# EAGLE design 1 (EAGLE 9.4.2)
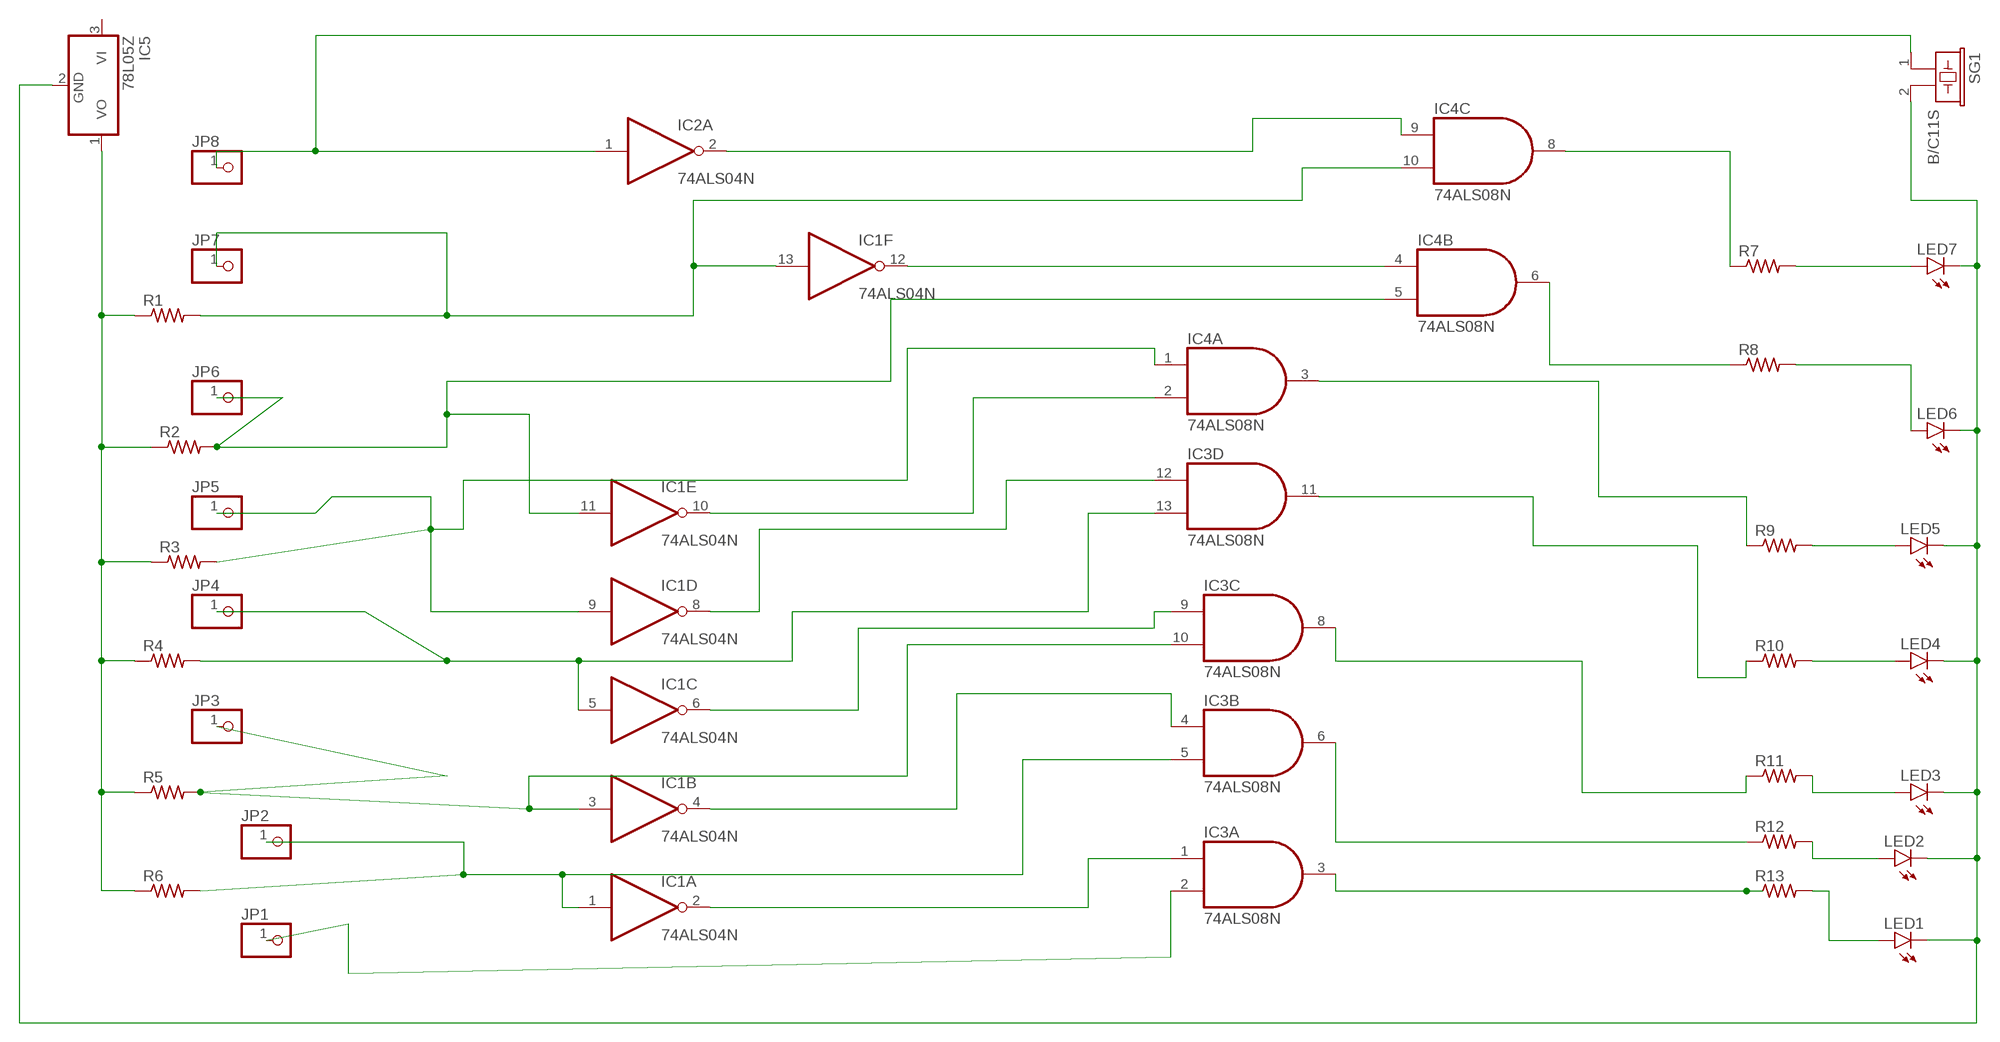
[diagram p0: schematic, sheet 1]

## Parts
IC1  74ALS04N  [DIL14]
IC2  74ALS04N  [DIL14]
IC3  74ALS08N  [DIL14]
IC4  74ALS08N  [DIL14]
IC5  78L05Z  [TO92]
JP1  PINHD-1X1  [1X01]
JP2  PINHD-1X1  [1X01]
JP3  PINHD-1X1  [1X01]
JP4  PINHD-1X1  [1X01]
JP5  PINHD-1X1  [1X01]
JP6  PINHD-1X1  [1X01]
JP7  PINHD-1X1  [1X01]
JP8  PINHD-1X1  [1X01]
LED1  LED10MM  [LED10MM]
LED2  LED10MM  [LED10MM]
LED3  LED10MM  [LED10MM]
LED4  LED10MM  [LED10MM]
LED5  LED10MM  [LED10MM]
LED6  LED10MM  [LED10MM]
LED7  LED10MM  [LED10MM]
R1  R-US_0204/5  [0204/5]
R2  R-US_0204/5  [0204/5]
R3  R-US_0204/5  [0204/5]
R4  R-US_0204/5  [0204/5]
R5  R-US_0204/5  [0204/5]
R6  R-US_0204/5  [0204/5]
R7  R-US_0204/5  [0204/5]
R8  R-US_0204/5  [0204/5]
R9  R-US_0204/5  [0204/5]
R10  R-US_0204/5  [0204/5]
R11  R-US_0204/5  [0204/5]
R12  R-US_0204/5  [0204/5]
R13  R-US_0204/5  [0204/5]
SG1  B/C11S  [B/C11S]

## Nets
N$1: IC1.1(A:I) IC3.5(B:I1) JP2.1 R6.2
N$2: IC1.3(B:I) IC3.10(C:I1) JP3.1 R5.2
N$3: IC1.5(C:I) IC3.13(D:I1) JP4.1 R4.2
N$4: IC1.9(D:I) IC4.1(A:I0) JP5.1 R3.2
N$5: IC1.11(E:I) IC4.5(B:I1) JP6.1 R2.2
N$6: IC1.13(F:I) IC4.10(C:I1) JP7.1 R1.2
N$7: IC1.2(A:O) IC3.1(A:I0)
N$8: IC1.4(B:O) IC3.4(B:I0)
N$9: IC1.6(C:O) IC3.9(C:I0)
N$10: IC1.8(D:O) IC3.12(D:I0)
N$11: IC1.10(E:O) IC4.2(A:I1)
N$12: IC1.12(F:O) IC4.4(B:I0)
N$13: IC3.2(A:I1) JP1.1
N$14: IC3.3(A:O) R13.1
N$15: IC4.8(C:O) R7.1
N$16: IC3.11(D:O) R10.1
N$17: IC4.3(A:O) R9.1
N$18: IC2.2(A:O) IC4.9(C:I0)
N$19: IC3.8(C:O) R11.1
N$20: IC3.6(B:O) R12.1
N$21: IC2.1(A:I) JP8.1 SG1.1
N$22: IC4.6(B:O) R8.1
N$23: LED1.A R13.2
N$24: LED2.A R12.2
N$25: LED3.A R11.2
N$26: LED4.A R10.2
N$27: LED5.A R9.2
N$28: LED6.A R8.2
N$29: LED7.A R7.2
N$30: IC5.1(VO) R1.1 R2.1 R3.1 R4.1 R5.1 R6.1
N$31: IC5.2(GND) LED1.K(C) LED2.K(C) LED3.K(C) LED4.K(C) LED5.K(C) LED6.K(C) LED7.K(C) SG1.2
Unconnected: IC2.3(B:I) IC2.4(B:O) IC2.5(C:I) IC2.6(C:O) IC2.8(D:O) IC2.9(D:I) IC2.10(E:O) IC2.11(E:I) IC2.12(F:O) IC2.13(F:I) IC4.11(D:O) IC4.12(D:I0) IC4.13(D:I1) IC5.3(VI)

## Power pins joined to a net without a drawn wire
GND: IC1.7(P:GND) IC2.7(P:GND) IC3.7(P:GND) IC4.7(P:GND)
VCC: IC1.14(P:VCC) IC2.14(P:VCC) IC3.14(P:VCC) IC4.14(P:VCC)

## Library data of the parts
IC1 IC2 = 74xx-us:74*04: Hex INVERTER
IC3 IC4 = 74xx-us:74*08: Quad 2-input AND gate
IC5 = linear:78*: Positive VOLTAGE REGULATOR Source: http://cache.national.com/ds/LM/LM78L05.pdf http://www.fairchildsemi.com/ds/LM/LM7805.pdf
JP1-JP8 = pinhead:PINHD-1X1: PIN HEADER
LED1-LED7 = led:LED: LED OSRAM: - CHIPLED LG R971, LG N971, LY N971, LG Q971, LY Q971, LO R971, LY R971 LH N974, LH R974 LS Q976, LO Q976, LY Q976 LO Q996 - Hyper CHIPLED LW Q18S LB Q993, LB Q99A, LB R99A - SideLED LS A670, LO A670, LY A670, LG A670, LP A670 LB A673, LV A673, LT A673, LW A673 LH A674 LY A675 LS A676, LA A676, LO A676, LY A676, LW A676 LS A679, LY A679, LG A679 - Hyper Micro SIDELED® LS Y876, LA Y876, LO Y876, LY Y876 LT Y87S - SmartLED LW L88C, LW L88S LB L89C, LB L89S, LG L890 LS L89K, LO L89K, LY L89K LS L896, LA L896, LO L896, LY L896 - TOPLED LS T670, LO T670, LY T670, LG T670, LP T670 LSG T670, LSP T670, LSY T670, LOP T670, LYG T670 LG T671, LOG T671, LSG T671 LB T673, LV T673, LT T673, LW T673 LH T674 LS T676, LA T676, LO T676, LY T676, LB T676, LH T676, LSB T676, LW T676 LB T67C, LV T67C, LT T67C, LS T67K, LO T67K, LY T67K, LW E67C LS E67B, LA E67B, LO E67B, LY E67B, LB E67C, LV E67C, LT E67C LW T67C LS T679, LY T679, LG T679 LS T770, LO T770, LY T770, LG T770, LP T770 LB T773, LV T773, LT T773, LW T773 LH T774 LS E675, LA E675, LY E675, LS T675 LS T776, LA T776, LO T776, LY T776, LB T776 LHGB T686 LT T68C, LB T68C - Hyper Mini TOPLED® LB M676 - Mini TOPLED Santana® LG M470 LS M47K, LO M47K, LY M47K Source: http://www.osram.convergy.de LUXEON: - LUMILED® LXK2-PW12-R00, LXK2-PW12-S00, LXK2-PW14-U00, LXK2-PW14-V00 LXK2-PM12-R00, LXK2-PM12-S00, LXK2-PM14-U00 LXK2-PE12-Q00, LXK2-PE12-R00, LXK2-PE12-S00, LXK2-PE14-T00, LXK2-PE14-U00 LXK2-PB12-K00, LXK2-PB12-L00, LXK2-PB12-M00, LXK2-PB14-N00, LXK2-PB14-P00, LXK2-PB14-Q00 LXK2-PR12-L00, LXK2-PR12-M00, LXK2-PR14-Q00, LXK2-PR14-R00 LXK2-PD12-Q00, LXK2-PD12-R00, LXK2-PD12-S00 LXK2-PH12-R00, LXK2-PH12-S00 LXK2-PL12-P00, LXK2-PL12-Q00, LXK2-PL12-R00 Source: www.luxeon.com KINGBRIGHT: KA-3528ASYC Source: www.kingbright.com
R1-R13 = rcl:R-US_: RESISTOR, American symbol; SPICEPREFIX: R
SG1 = buzzer:B/C11S: BUZZER Source: Buerklin; OC_FARNELL: unknown; OC_NEWARK: unknown

## Board
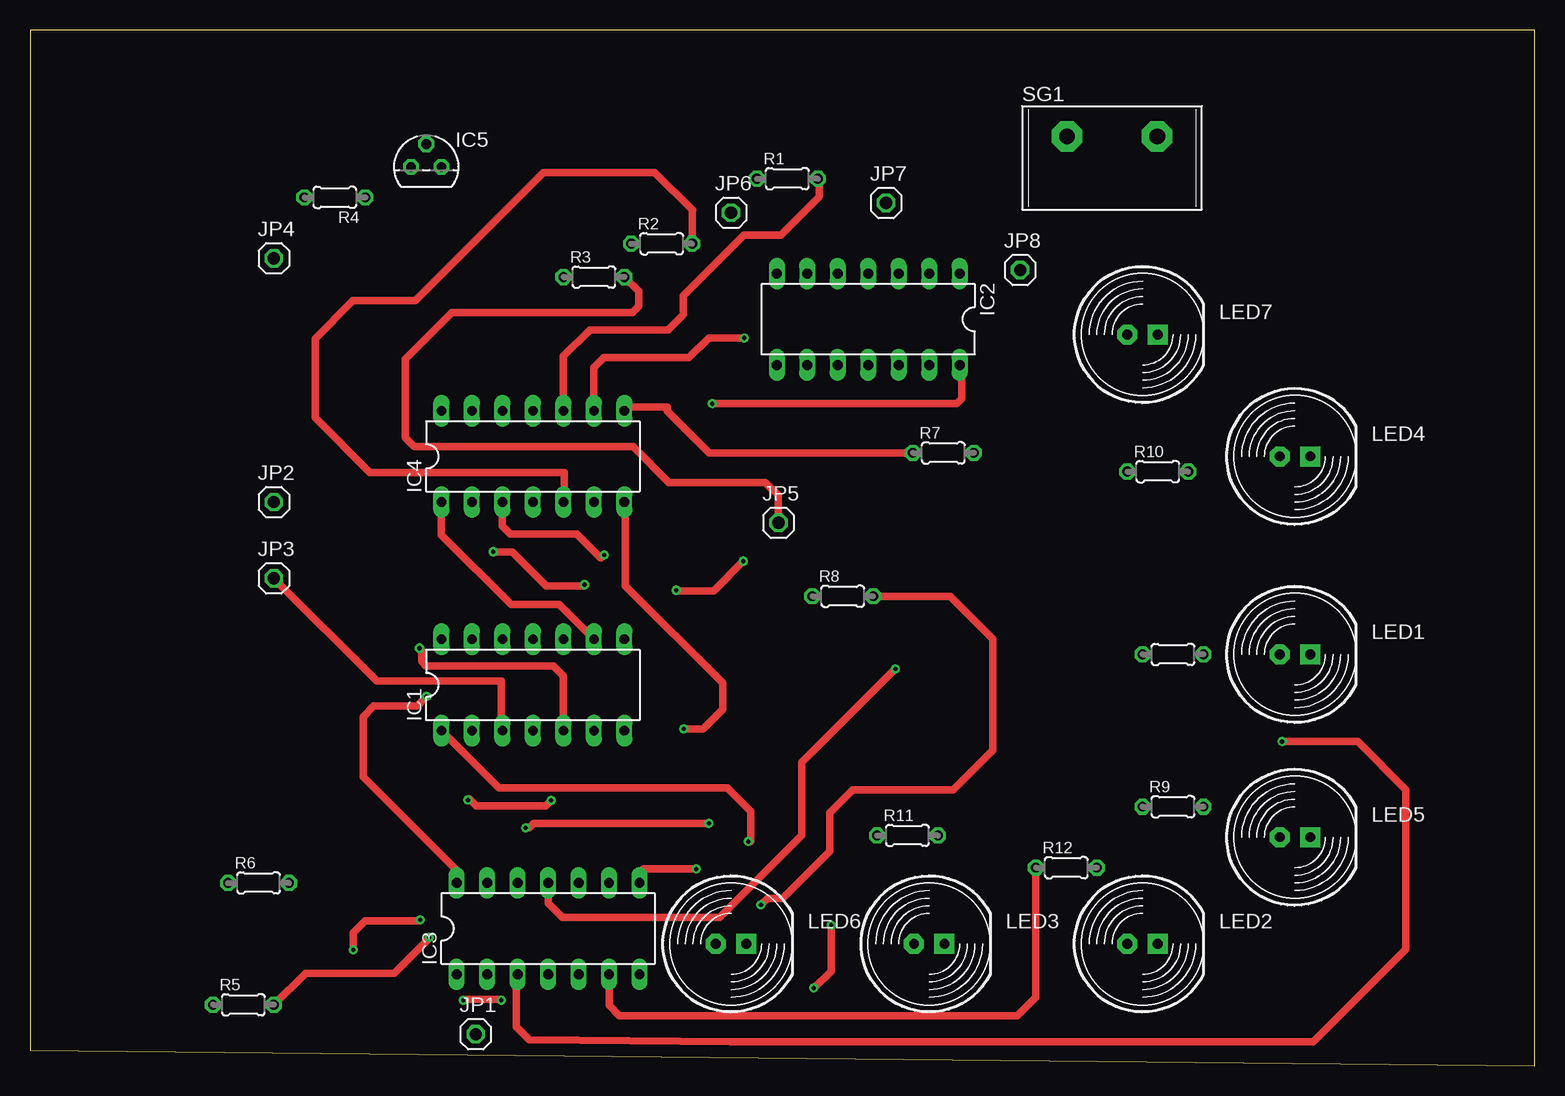
[diagram p1: board, top side]
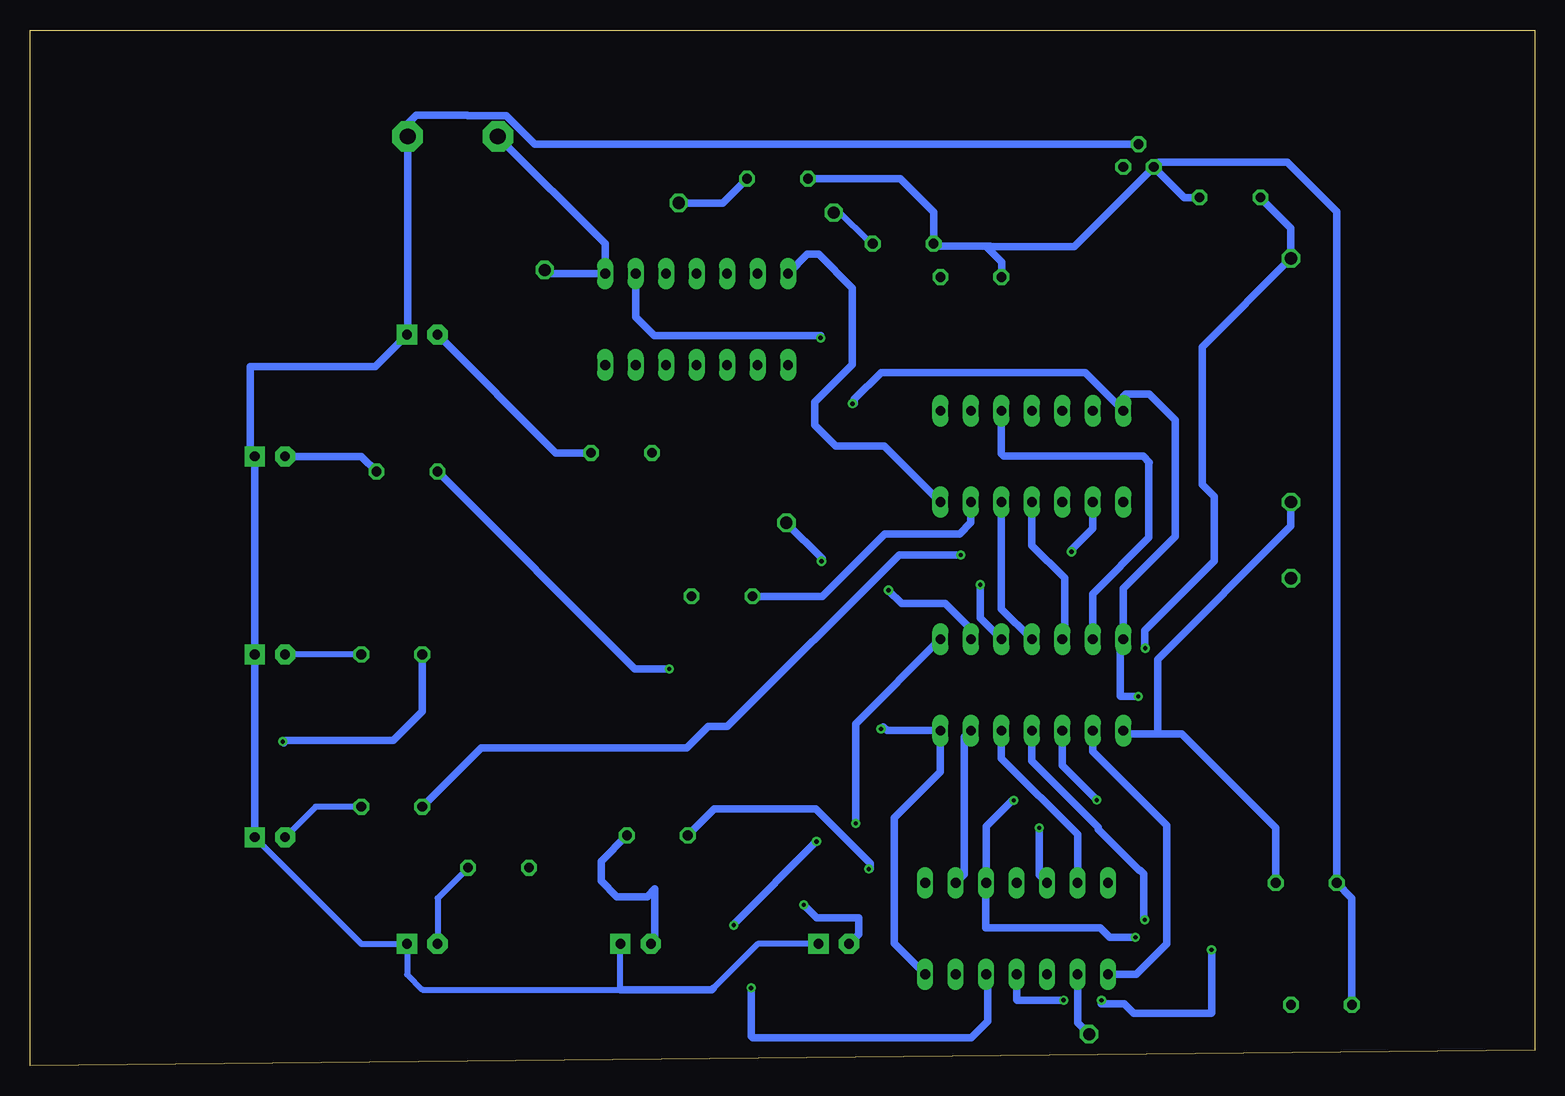
[diagram p2: board, bottom side, seen from below]

Size 125.4 x 86.35 mm. Coordinates in mm from the lower left corner, seen from the top.
Outline: 0,1.27 125.4,0 125.4,86.35 0,86.35 0,1.27
Copper layers (1*16): Top 0.035mm / dielectric 1.5mm / Bottom 0.035mm
Design rules "default": minimum track width 6mil, minimum drill 0.35mm, track to track 6mil, track to pad 6mil, pad to pad 6mil, via to via 6mil, smd to smd 6mil, copper to edge 40mil, drill to drill 6mil, minimum pad ring 10mil, minimum via ring 8mil, stop-mask expansion 4mil, vias tented up to drill 0mil, thermal gap 10mil

### Footprints (pad centres in the part's own frame; a part is rotated, then mirrored left to right if it is on the bottom)
DIL14 = drill 0.813 long: 1 -7.62,-3.81; 2 -5.08,-3.81; 3 -2.54,-3.81; 4 0,-3.81; 5 2.54,-3.81; 6 5.08,-3.81; 7 7.62,-3.81; 8 7.62,3.81; 9 5.08,3.81; 10 2.54,3.81; 11 0,3.81; 12 -2.54,3.81; 13 -5.08,3.81; 14 -7.62,3.81
TO92 = drill 0.813 octagon: 1 -1.27,0; 2 0,1.905; 3 1.27,0
1X01 = drill 1.016 octagon: 1 0,0
LED10MM = drill 0.813 pad 1.676 octagon: A -1.27,0 | drill 0.813 pad 1.676 square: K 1.27,0
0204/5 = drill 0.813 octagon: 1 -2.54,0; 2 2.54,0
B/C11S = drill 1.321 pad 2.54 octagon: 1 -3.759,0; 2 3.759,0

### Placement (x,y rotation side)
IC1  41.91,31.75 0 top
IC2  69.85,62.23 180 top
IC3  43.18,11.43 0 top
IC4  41.91,50.8 0 top
IC5  33.02,74.93 0 top
JP1  37.14,2.63 0 top
JP2  20.32,46.99 0 top
JP3  20.32,40.64 0 top
JP4  20.32,67.31 0 top
JP5  62.37,45.26 0 top
JP6  58.42,71.12 0 top
JP7  71.34,71.93 0 top
JP8  82.51,66.34 0 top
LED1  105.41,34.29 0 top
LED2  92.71,10.16 0 top
LED3  74.93,10.16 0 top
LED4  105.41,50.8 0 top
LED5  105.41,19.05 0 top
LED6  58.42,10.16 0 top
LED7  92.71,60.96 0 top
R1  63.11,73.95 0 top
R2  52.64,68.53 0 top
R3  46.99,65.75 0 top
R4  25.4,72.39 180 top
R5  17.78,5.08 0 top
R6  19.05,15.24 0 top
R7  76.11,51.09 0 top
R8  67.73,39.14 0 top
R9  95.25,21.59 0 top
R10  93.98,49.53 0 top
R11  73.12,19.2 0 top
R12  86.36,16.51 0 top
R13  95.25,34.29 0 top
SG1  90.17,77.47 0 top

### Tracks (layer width: path | path; a pad name or v marks a point on that pad's centre or on a via)
GND  (via drill 0.35)
  Top 0.61: v54.48,28.07 56.09,28.07 57.72,29.71 57.72,31.91 49.62,40.01 49.62,47.24 49.53,47.15 IC4.7
  Bottom 0.61: IC3.7 53.38,10.2 53.38,20.66 49.53,24.51 IC1.7 53.98,27.94 54.3,28.26 v54.48,28.07 | IC4.7 54.22,51.68 58.25,51.68 60,53.43 60,55.33 56.88,58.45 56.88,64.84 59.69,67.65 60.62,67.65 IC2.7
N$1  (via drill 0.35)
  Top 0.61: IC1.1 39.05,23.18 58.11,23.18 60.08,21.21 60.08,18.69 v59.86,18.69 | v66.76,11.72 66.76,7.89 65.33,6.46 v65.31,6.48
  Bottom 0.61: JP2.1 20.32,45 31.44,33.88 31.44,27.65 | 31.44,27.65 34,27.65 IC1.1 | R6.2 21.59,19.81 29.43,27.65 31.44,27.65 | v59.86,18.69 66.72,11.83 66.72,11.72 v66.76,11.72 | v65.31,6.48 65.31,2.47 65.16,2.32 46.97,2.32 45.6,3.69 45.6,7.5 IC3.5
N$2  (via drill 0.35)
  Top 0.61: JP3.1 28.88,32.08 39.25,32.08 39.25,28.06 IC1.3 | R5.2 22.96,7.72 30.34,7.72 33.3,10.68 v33.28,10.7 | v43.42,22.11 42.96,21.65 37.18,21.65 36.59,22.24 v36.49,22.14
  Bottom 0.61: v33.28,10.7 35.43,10.7 36.22,11.49 45.74,11.49 45.74,15.22 IC3.10 45.72,19.94 43.55,22.11 v43.42,22.11 | v36.49,22.14 39.37,25.02 IC1.3
N$3  (via drill 0.35)
  Top 0.61: v32.46,34.81 32.65,34.62 32.65,33.69 32.99,33.35 43.59,33.35 44.45,32.49 IC1.5
  Bottom 0.61: IC3.13 38.1,19.29 44.45,25.64 IC1.5 | R4.2 20.32,69.85 JP4.1 27.7,59.93 27.7,48.46 26.71,47.47 26.71,42.1 32.51,36.3 32.51,34.86 v32.46,34.81
N$4  (via drill 0.35)
  Top 0.61: IC1.9 44.11,38.44 40.11,38.44 34.29,44.26 IC4.1 | v59.44,42.06 56.98,39.6 53.86,39.6 v53.86,39.64 | JP5.1 62.37,47.56 61.29,48.64 53.24,48.64 50.27,51.61 32.03,51.61 31.27,52.37 31.27,58.91 35.15,62.79 46.9,62.79 50.19,62.79 50.72,63.32 50.72,64.56 R3.2
  Bottom 0.61: JP5.1 59.4,42.29 59.4,42.06 v59.44,42.06 | v53.86,39.64 52.77,38.55 49.12,38.55 46.99,36.42 IC1.9
N$5
  Top 0.61: R2.2 55.18,71.28 55.21,71.31 52.07,74.44 42.77,74.44 32.11,63.78 26.91,63.78 23.75,60.62 23.75,54.03 28.31,49.47 44.52,49.47 44.52,47.06 IC4.5
  Bottom 0.508: JP6.1 58.16,71.38 55.3,68.53 R2.2
  Bottom 0.61: IC4.5 44.45,38.1 IC1.11
N$6
  Top 0.61: IC4.10 44.45,59.16 46.64,61.35 53.15,61.35 54.43,62.63 54.43,64.22 59.46,69.25 62.56,69.25 65.76,72.45 65.76,73.84 R1.2
  Bottom 0.61: JP7.1 67.67,71.93 R1.2 | IC1.13 36.83,39.35 32.16,44.02 32.16,50.23 32.11,50.28 32.64,50.81 44.24,50.81 44.45,51.02 IC4.10
N$7
  Bottom 0.61: IC3.1 33.21,7.62 30.66,10.17 30.66,20.05 36.83,26.22 IC1.2
N$8  (via drill 0.35)
  Top 0.61: v32.51,12.17 32.42,12.08 27.94,12.08 26.93,11.07 v26.93,9.67 v26.94,9.67 | v36.11,5.45 36.19,5.53 39.31,5.53 39.24,5.46 v39.26,5.46 | v39.27,5.46 v39.26,5.46 | v39.26,5.46 v39.27,5.47
  Bottom 0.61: IC1.4 41.91,25.4 36.37,19.86 36.37,19.69 32.98,16.3 32.9,16.3 32.6,16 32.6,12.17 v32.51,12.17 | v26.94,9.67 26.94,4.42 26.97,4.39 33.43,4.39 34.22,5.18 36.11,5.18 v36.11,5.45 | v39.27,5.47 43.15,5.47 43.18,5.5 IC3.4
N$9
  Bottom 0.61: IC1.6 47.53,27.4 47.53,15.97 IC3.9
N$10  (via drill 0.35)
  Top 0.61: v56.58,20.2 41.98,20.2 41.6,19.82 v41.3,19.82
  Bottom 0.61: IC1.8 56.58,28.51 v56.58,20.2 | v41.3,19.82 41.3,15.9 IC3.12
N$11  (via drill 0.35)
  Top 0.61: v38.61,42.85 40.19,42.85 43.04,40 46.21,40 v46.21,40.1
  Bottom 0.61: IC4.2 36.83,44.78 38.66,42.95 38.66,42.85 v38.61,42.85 | v46.21,40.1 46.21,37.32 IC1.10
N$12
  Bottom 0.61: IC4.4 41.91,43.37 39.19,40.65 39.19,35.74 IC1.12
N$13
  Bottom 0.61: IC3.2 38.1,3.59 JP1.1
N$14  (via drill 0.35)
  Top 0.61: v104.34,27.02 110.64,27.02 114.66,23 114.66,9.72 106.94,2 58.41,2 41.61,2.17 40.54,3.24 40.54,7.52 IC3.3
  Bottom 0.61: R13.1 92.71,29.53 95.13,27.11 104.07,27.11 104.25,26.93 v104.34,27.02
N$15
  Top 0.61: R7.1 56.59,51.09 53.11,54.57 53.11,54.93 49.85,54.93 IC4.8
N$16  (via drill 0.35)
  Top 0.61: v72.12,33.09 64.33,25.3 64.33,19.21 57.49,12.37 44.34,12.37 43.18,13.53 IC3.11
  Bottom 0.61: R10.1 75,33.09 v72.12,33.09
N$17  (via drill 0.35)
  Top 0.61: IC4.3 39.37,44.99 40.03,44.33 45.56,44.33 47.57,42.32 v47.84,42.59
  Bottom 0.61: v47.84,42.59 52.98,42.59 67.28,28.28 68.88,28.28 70.67,26.49 87.81,26.49 R9.1
N$18  (via drill 0.35)
  Top 0.61: v59.52,60.68 56.55,60.68 54.9,59.03 47.83,59.03 46.99,58.19 IC4.9
  Bottom 0.61: IC2.2 74.93,62.42 73.38,60.87 59.52,60.87 v59.52,60.68
N$19  (via drill 0.35)
  Top 0.61: v55.51,16.4 51.1,16.4 50.8,16.1 IC3.8 | IC3.8 50.8,14.95 51.1,14.65 51.1,14.94 IC3.8
  Bottom 0.61: R11.1 68.36,21.42 59.92,21.42 55.36,16.86 55.36,16.4 v55.51,16.4
N$20
  Top 0.61: IC3.6 48.26,5.02 49.11,4.17 82.27,4.17 83.82,5.72 R12.1
N$21
  Bottom 0.61: SG1.1 77.47,68.53 IC2.1 82.21,66.04 JP8.1
N$22
  Bottom 0.61: IC4.6 46.99,45.28 47.94,44.33 54.19,44.33 59.38,39.14 R8.1
N$23
  Bottom 0.508: R13.2 LED1.A
N$24
  Bottom 0.508: R12.2 91.44,13.97 LED2.A
N$25
  Bottom 0.61: R11.2 77.81,17.05 77.81,15.4 76.5,14.09 73.98,14.09 73.32,14.75 73.32,10.5 LED3.A
N$26
  Bottom 0.61: R10.2 97.79,50.8 LED4.A
N$27
  Bottom 0.508: R9.2 101.6,21.59 LED5.A
N$28  (via drill 0.35)
  Top 0.61: R8.2 76.69,39.14 80.24,35.59 80.24,26.29 76.95,23 68.57,23 66.65,21.08 66.65,17.88 62.73,13.96 61.46,13.96 v60.91,13.41
  Bottom 0.61: v60.91,13.41 59.82,12.32 56.35,12.32 56.35,10.96 LED6.A
N$29
  Bottom 0.61: LED7.A 81.57,51.09 R7.2
N$30
  Bottom 0.61: R1.1 52.87,73.95 50.1,71.18 R2.1 49.88,68.31 45.74,68.31 | 45.74,68.31 45.37,68.31 45.36,68.3 38.38,68.3 IC5.1 | 45.74,68.31 44.44,67.01 R3.1 | IC5.1 29.21,72.39 R4.1 | R5.1 15.24,13.97 R6.1 16.51,71.22 20.64,75.35 31.33,75.35 IC5.1
N$31
  Bottom 0.508: 106.42,18.79 97.79,10.16 LED2.K 93.98,7.62 92.71,6.35 76.2,6.35 LED3.K | LED6.K 64.77,10.16 68.48,6.46
  Bottom 0.61: IC5.2 83.33,76.83 85.7,79.2 88.92,79.2 88.97,79.25 93.2,79.25 93.93,78.52 SG1.2 93.93,61.01 LED7.K 96.64,58.3 107.03,58.3 107.03,51.15 LED4.K LED1.K LED5.K 106.42,18.79 | 76.2,6.35 68.58,6.35 68.48,6.46
VCC  (via drill 0.35)
  Top 0.61: v56.86,55.19 77.21,55.19 77.64,55.62 77.64,58.25 IC2.14 | v33.04,30.78 32.25,29.99 28.66,29.99 27.77,29.1 27.77,24.09 35.56,16.3 IC3.14
  Bottom 0.61: v56.86,55.19 56.7,55.19 56.7,55.56 54.48,57.78 37.46,57.78 IC4.14 34.29,55.78 34.08,55.99 32.13,55.99 29.96,53.82 29.96,44.11 34.29,39.78 IC1.14 34.56,35.29 34.56,30.85 34.49,30.78 v33.04,30.78